# EAGLE design B312B (EAGLE 6.6.0)
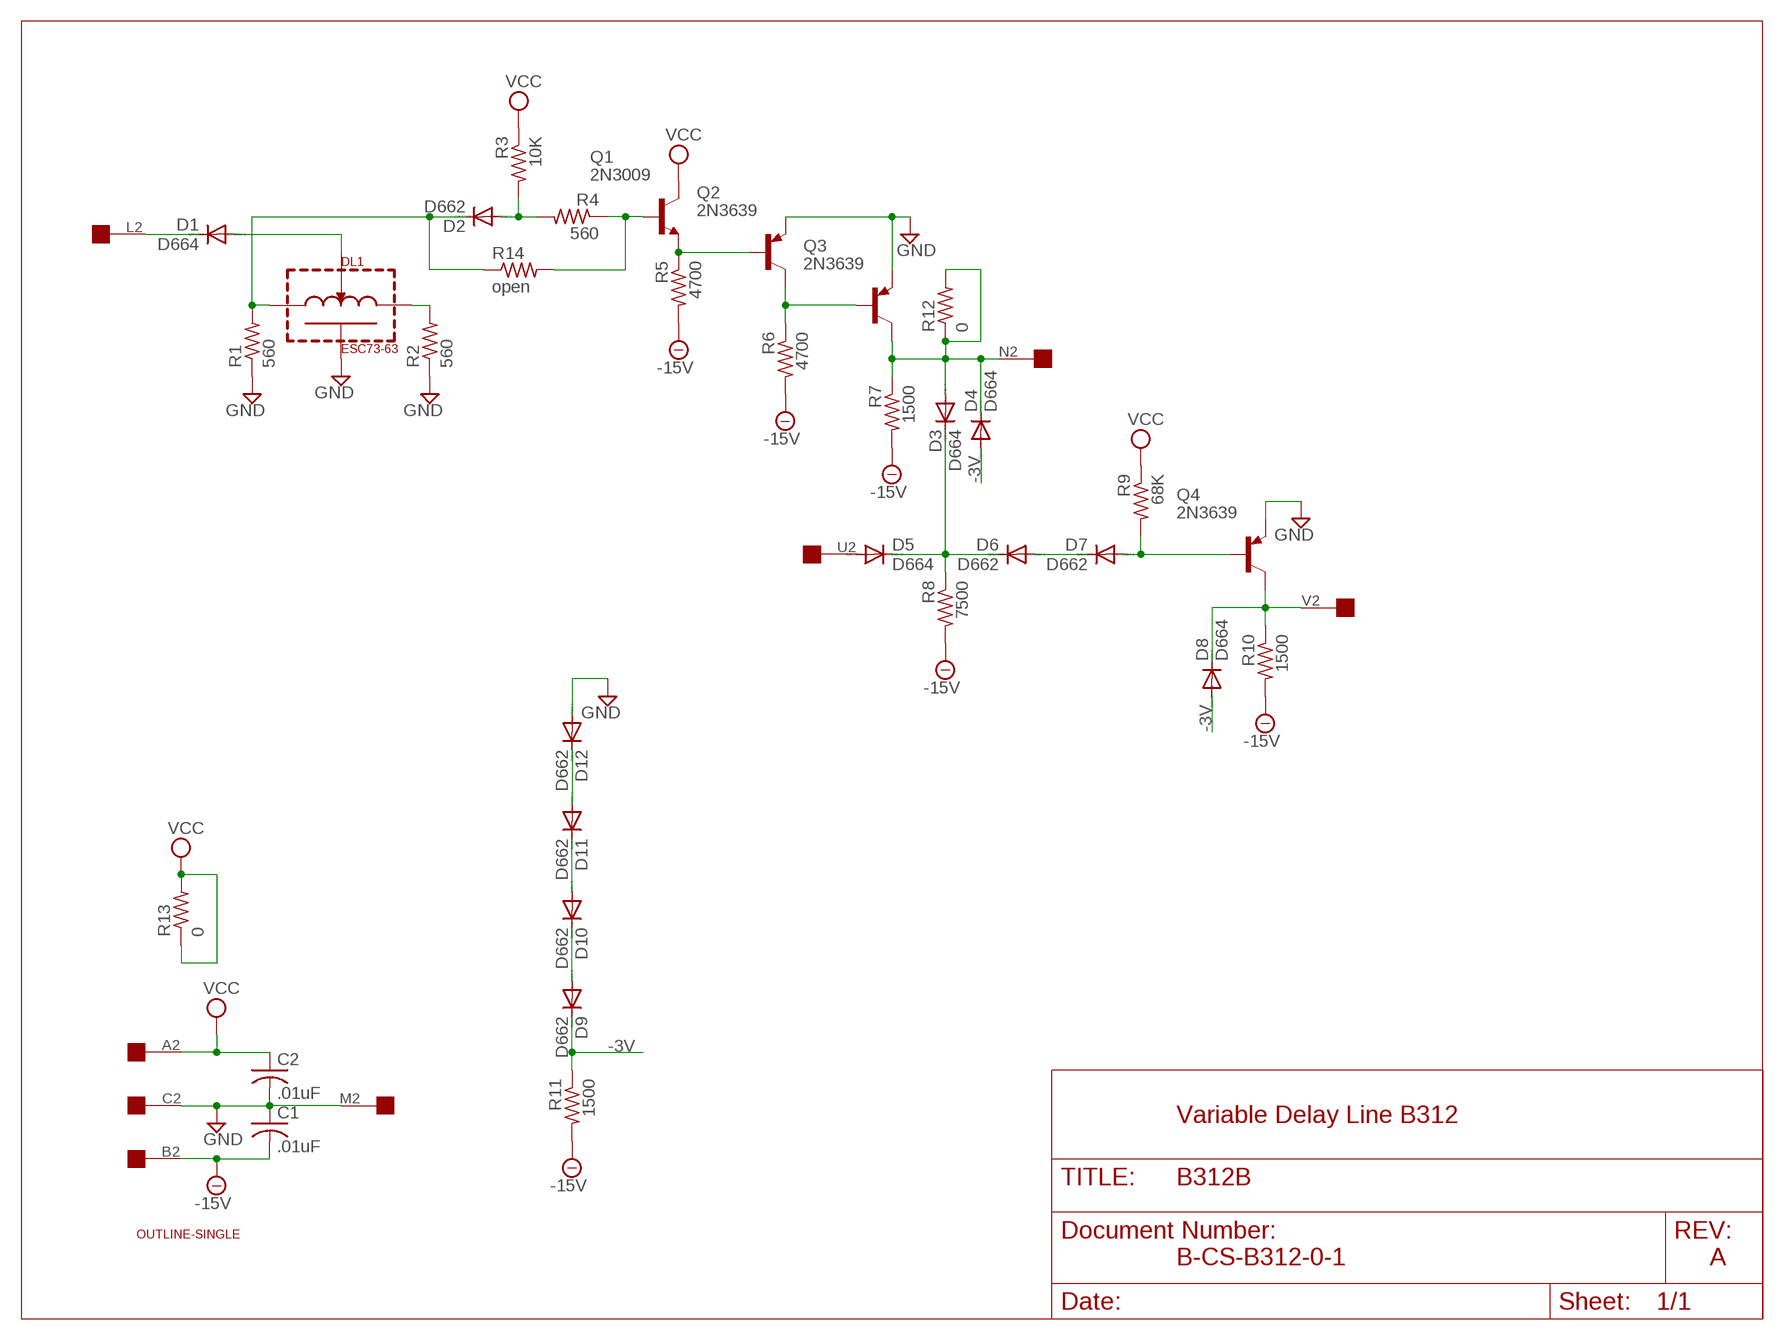
[diagram p0: schematic, sheet 1]

## Parts
C1  .01uF  C-US  [C063-025X075]
C2  .01uF  C-US  [C063-025X075]
D1  D664  DIODE-DO35-10  [DO35-10]
D2  D662  DIODE-DO35-10  [DO35-10]
D3  D664  DIODE-DO35-10  [DO35-10]
D4  D664  DIODE-DO35-10  [DO35-10]
D5  D664  DIODE-DO35-10  [DO35-10]
D6  D662  DIODE-DO35-10  [DO35-10]
D7  D662  DIODE-DO35-10  [DO35-10]
D8  D664  DIODE-DO35-10  [DO35-10]
D9  D662  DIODE-DO35-10  [DO35-10]
D10  D662  DIODE-DO35-10  [DO35-10]
D11  D662  DIODE-DO35-10  [DO35-10]
D12  D662  DIODE-DO35-10  [DO35-10]
DL1  ESC73-63  DELAYLINE  [DELAYLINE]
Q1  2N3009  -NPN-TO5  [TO5]
Q2  2N3639  -PNP-TO5  [TO5]
Q3  2N3639  -PNP-TO5  [TO5]
Q4  2N3639  -PNP-TO5  [TO5]
R1  560  R-US_0207/10  [0207/10]
R2  560  R-US_0207/10  [0207/10]
R3  10K  R-US_0207/10  [0207/10]
R4  560  R-US_0207/10  [0207/10]
R5  4700  R-US_0207/10  [0207/10]
R6  4700  R-US_0207/10  [0207/10]
R7  1500  R-US_0207/10  [0207/10]
R8  7500  R-US_0207/10  [0207/10]
R9  68K  R-US_0207/10  [0207/10]
R10  1500  R-US_0207/10  [0207/10]
R11  1500  R-US_0207/10  [0207/10]
R12  0  R-US_0207/10  [0207/10]
R13  0  R-US_0207/10  [0207/10]
R14  open  R-US_0207/10  [0207/10]
U$1  OUTLINE-SINGLE  [SINGLE]
U$2  EDGE-1  [EDGE-CON1]

## Nets
-3V: D4.A D8.A D9.C R11.1
-15V: C1.2 R5.2 R6.2 R7.2 R8.2 R10.2 R11.2 U$2.B2
GND: C1.1 C2.2 D12.A DL1.G Q2.1(E) Q3.1(E) Q4.1(E) R1.1 R2.1 U$2.C2 U$2.M2
N$1: D2.C DL1.L R1.2 R14.1
N$2: DL1.R R2.2
N$3: D1.A DL1.V
N$17: D1.C U$2.L2
N$18: D2.A R3.2 R4.2
N$19: Q1.2(B) R4.1 R14.2
N$21: Q1.1(E) Q2.2(B) R5.1
N$22: Q2.3(C) Q3.2(B) R6.1
N$23: D3.A D4.C Q3.3(C) R7.1 R12.1 R12.2 U$2.N2
N$24: D11.A D12.C
N$25: D9.A D10.C
N$26: D10.A D11.C
N$27: D5.A U$2.U2
N$28: D3.C D5.C D6.C R8.1
N$29: D6.A D7.C
N$30: D7.A Q4.2(B) R9.2
N$31: D8.C Q4.3(C) R10.1 U$2.V2
VCC: C2.1 Q1.3(C) R3.1 R9.1 R13.1 R13.2 U$2.A2
Unconnected: U$2.D2 U$2.E2 U$2.F2 U$2.H2 U$2.J2 U$2.K2 U$2.P2 U$2.R2 U$2.S2 U$2.T2

## Notes on the sheet
- Variable Delay Line B312
- B-CS-B312-0-1 | A

## Library data of the parts
C1 C2 = dec-con:C-US: Capacitors with funky DEC lead spacing.
D1-D12 = diode:DIODE-: DIODE
DL1 = dec-con:DELAYLINE: Delay Line
Q1 = transistor:*-NPN-: NPN Transistror BF959 corrected 2008.03.06
Q2-Q4 = transistor:*-PNP-: PNP Transistror
R1-R14 = rcl:R-US_: RESISTOR, American symbol
U$1 = dec-con:OUTLINE-*: Board outlines for DEC boards.
U$2 = dec-con:EDGE-1: Single-Sided DEC Edge Connector -- (side 2)

## Net classes
0 default: width 0.813 mm

## Board
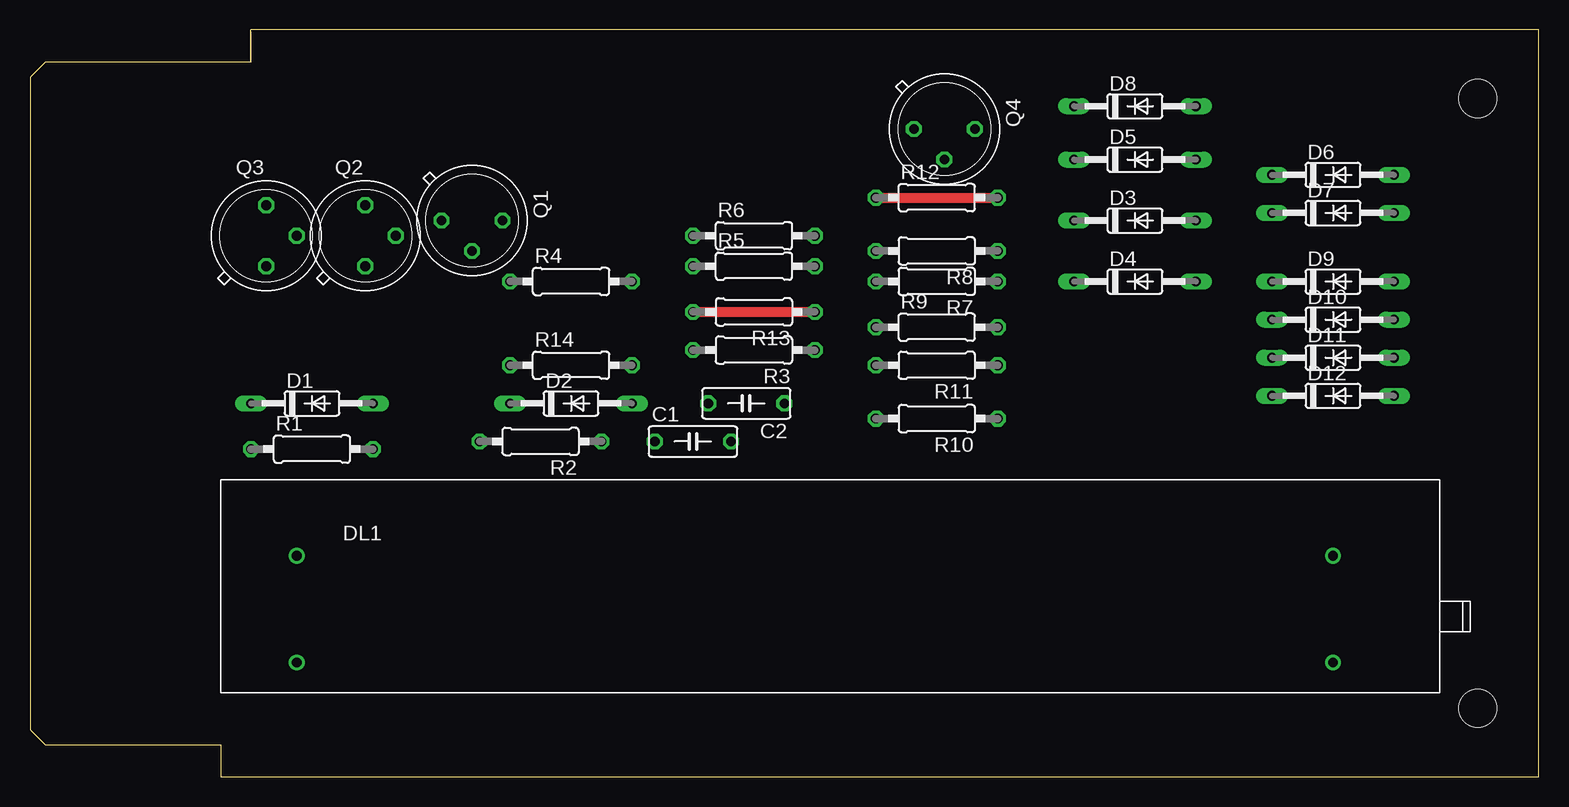
[diagram p1: board, top side]
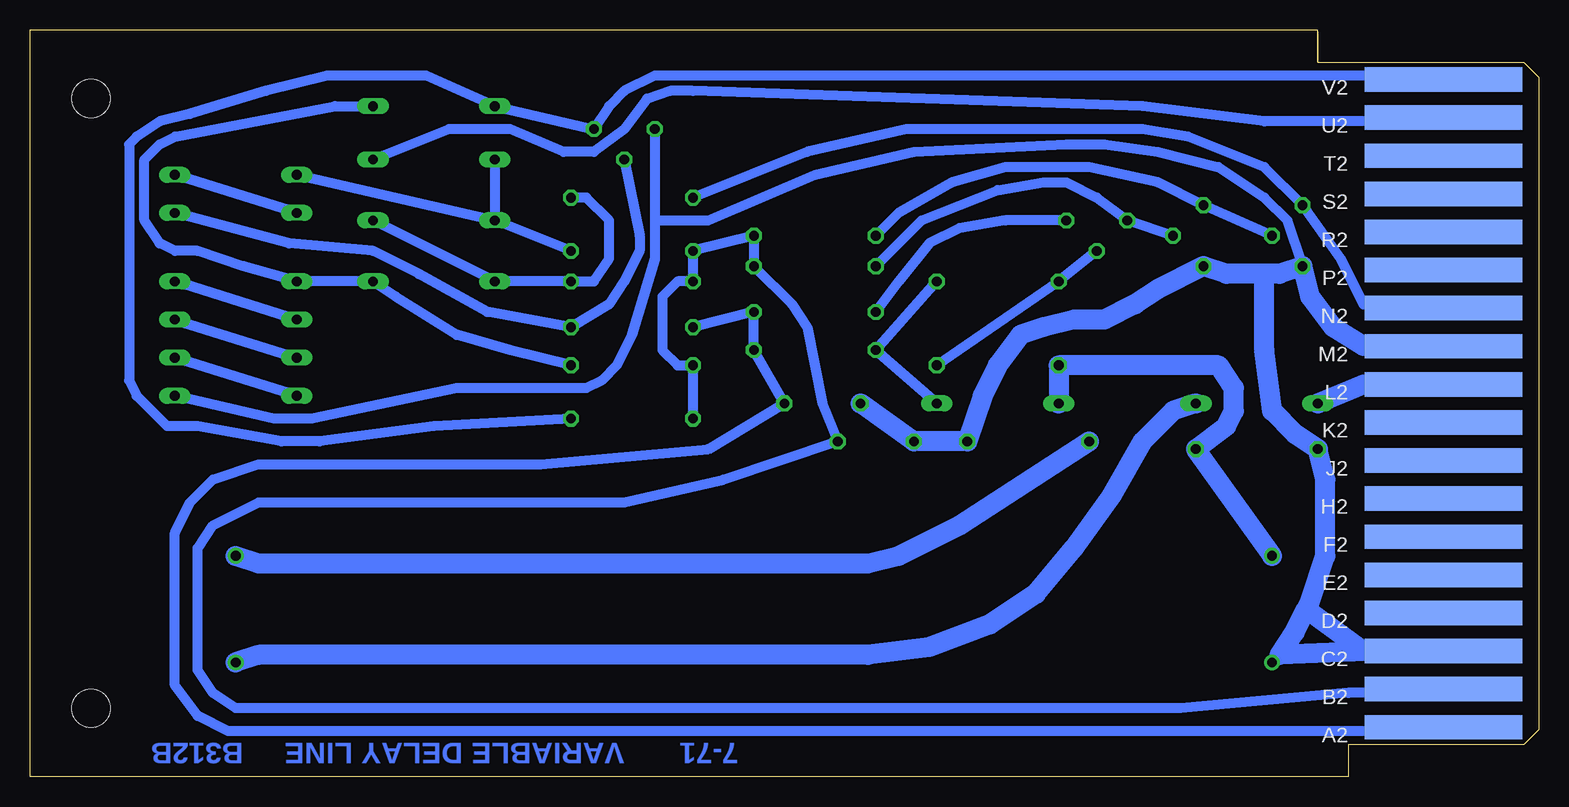
[diagram p2: board, bottom side, seen from below]

Size 125.73 x 62.23 mm. Coordinates in mm from the lower left corner, seen from the top.
Copper layers (1+16): Top 0.035mm / dielectric 1.5mm / Bottom 0.035mm
Design rules "16mils": minimum track width 16mil, minimum drill 32mil, track to track 15mil, track to pad 10mil, pad to pad 10mil, via to via 10mil, smd to smd 10mil, copper to edge 13mil, drill to drill 10mil, minimum pad ring 10mil, minimum via ring 8mil, stop-mask expansion 0mil, vias tented up to drill 0mil, thermal gap 10mil

### Footprints (pad centres in the part's own frame; a part is rotated, then mirrored left to right if it is on the bottom)
C063-025X075 = drill 0.813 octagon: 1 -2.54,0; 2 3.81,0
DO35-10 = drill 0.813 long: A 5.08,0; C -5.08,0
DELAYLINE = drill 0.813: G -44.45,-7.62; L -44.45,1.27; R 41.91,1.27; V 41.91,-7.62
TO5 = drill 0.813 octagon: 1 0,-2.54; 2 2.54,0; 3 0,2.54
0207/10 = drill 0.813 octagon: 1 -5.08,0; 2 5.08,0
SINGLE = hole 3.175: 120.65,56.515; 120.65,5.715
EDGE-CON1 = smd 13.106 x 2.032 bottom: A2 7.938,4.128; B2 7.938,7.303; C2 7.938,10.477; D2 7.938,13.652; E2 7.938,16.828; F2 7.938,20.003; H2 7.938,23.177; J2 7.938,26.352; K2 7.938,29.527; L2 7.938,32.703; M2 7.938,35.877; N2 7.938,39.053; P2 7.938,42.227; R2 7.938,45.403; S2 7.938,48.578; T2 7.938,51.752; U2 7.938,54.928; V2 7.938,58.102

### Placement (x,y rotation side)
C1  54.61,27.94 0 top
C2  60.33,31.11 180 top
D1  23.5,31.11 0 top
D2  45.09,31.11 0 top
D3  92.08,46.35 0 top
D4  92.08,41.27 0 top
D5  92.08,51.44 0 top
D6  108.59,50.16 0 top
D7  108.59,46.99 0 top
D8  92.08,55.88 0 top
D9  108.59,41.27 0 top
D10  108.59,38.1 0 top
D11  108.59,34.92 0 top
D12  108.59,31.75 0 top
DL1  66.68,17.14 0 top
Q1  36.83,46.35 270 top
Q2  27.94,45.09 0 top
Q3  19.69,45.09 0 top
Q4  76.2,53.98 270 top
R1  23.5,27.3 0 top
R2  42.55,27.94 180 top
R3  60.33,35.56 180 top
R4  45.09,41.27 0 top
R5  60.33,42.55 0 top
R6  60.33,45.09 0 top
R7  75.57,41.27 180 top
R8  75.57,43.81 180 top
R9  75.57,37.47 0 top
R10  75.57,29.84 180 top
R11  75.57,34.29 180 top
R12  75.57,48.26 0 top
R13  60.33,38.73 180 top
R14  45.09,34.29 0 top
U$1  0,0 0 top
U$2  0,0 0 top

### Tracks (layer width: path | path; a pad name or v marks a point on that pad's centre or on a via)
-3V
  Bottom 0.813: R11.1 85.73,35.56 90.17,36.83 95.25,40.01 D4.A D9.C 107.95,42.55 111.76,43.81 113.67,43.81 114.94,44.45 116.21,46.35 116.21,51.44 114.94,52.7 113.67,53.34 100.33,55.88 D8.A
-15V
  Bottom 0.813: U$2.B2 10.16,6.99 15.88,6.99 29.85,5.71 108.59,5.71 110.49,6.99 111.76,8.89 111.76,19.05 110.49,20.95 106.68,22.86 76.2,22.86 67.95,24.77 C1.2 59.69,31.11 60.96,37.47 62.23,39.37 R5.2 R6.2 R8.2 R7.2 71.76,41.27 73.03,40.01 73.03,35.56 71.76,34.29 R11.2 R10.2
GND
  Bottom 0.813: U$2.M2 14.61,35.88 | U$2.C2 13.97,10.48 14.29,10.48 | 21.59,10.16 DL1.G | Q4.1 73.66,46.35 | 73.66,46.35 69.22,46.35 60.33,50.16 52.07,52.07 39.37,52.7 36.2,52.7 31.75,52.07 26.67,50.8 22.86,48.26 20.96,46.35 Q3.1 | 73.66,46.35 73.66,43.18 75.57,36.83 76.84,34.29 78.11,33.02 79.38,32.38 90.17,32.38 102.24,29.84 105.41,29.84 D12.A
  Bottom 1.676: C2.2 C1.1 R2.1 46.36,31.75 45.09,34.29 43.18,36.83 41.28,37.47 38.74,38.1 36.2,38.1 33.66,39.37 31.75,40.64 Q2.1 26.04,41.91 22.86,41.91 | 22.86,41.91 21.59,41.91 Q3.1 19.05,40.01 17.15,37.47 14.61,35.88 | 14.29,10.48 21.59,10.16 20.32,12.06 19.37,13.97 | 19.37,13.97 19.05,14.61 17.78,18.41 17.78,24.77 R1.1 20.32,28.57 22.23,30.48 22.86,35.56 22.86,41.91 | 13.97,10.48 14.61,10.48 19.37,13.97
N$1
  Bottom 1.676: D2.C R14.1 26.67,34.29 25.4,32.38 25.4,30.48 26.04,29.21 R1.2 DL1.L
N$2
  Bottom 1.676: DL1.R 106.68,17.78 55.88,17.78 53.34,18.41 48.26,20.95 R2.2
N$3
  Bottom 1.676: D1.A 30.48,30.48 33.02,27.94 35.56,23.5 38.74,19.05 41.91,15.24 45.72,12.7 50.8,10.79 55.88,10.16 106.68,10.16 DL1.V
N$17
  Bottom 0.813: U$2.L2 14.61,32.7
  Bottom 1.676: 14.61,32.7 D1.C
N$18
  Bottom 0.813: R4.2 R3.2 D2.A
N$19
  Bottom 0.813: R14.2 R4.1 Q1.2
N$21
  Bottom 0.813: R5.1 51.44,46.35 45.09,48.9 41.28,49.53 39.37,49.53 36.83,48.26 Q1.1 Q2.2
N$22
  Bottom 0.813: Q3.2 Q2.3 31.75,49.53 37.47,50.8 44.45,50.8 48.9,49.53 53.34,46.99 R6.1
N$23
  Top 0.813: R12.1 R12.2
  Bottom 0.813: U$2.N2 8.89,39.37 14.61,39.37 16.51,43.18 Q3.3 22.86,50.8 29.21,53.34 33.02,53.98 52.71,53.98 60.96,52.07 R12.1 | R12.2 79.38,48.26 77.47,46.35 77.47,43.18 78.74,41.27 R7.1 D4.C D3.A
N$24
  Bottom 0.813: D12.C D11.A
N$25
  Bottom 0.813: D10.C D9.A
N$26
  Bottom 0.813: D10.A D11.C
N$27
  Bottom 0.813: U$2.U2 8.89,54.61 22.86,54.61 33.02,55.88 70.49,57.15 72.39,57.15 74.3,56.52 76.2,53.98 78.74,52.07 81.28,52.07 85.73,53.98 90.81,53.98 D5.A
N$28
  Bottom 0.813: D5.C D3.C | R8.1 D3.C | D6.C D3.C
N$29
  Bottom 0.813: D7.C D6.A
N$30
  Bottom 0.813: D7.A 104.14,44.45 97.16,43.81 93.35,41.91 87.63,38.73 R9.2 77.47,39.37 76.2,41.27 74.93,43.81 74.93,45.09 Q4.2
N$31
  Bottom 0.813: U$2.V2 8.89,58.42 73.66,58.42 76.2,57.15 77.47,55.88 Q4.3 D8.C 92.71,58.42 100.97,58.42 106.05,57.15 112.4,55.24 114.94,54.61 116.84,53.34 117.48,52.7 117.48,33.02 116.84,31.75 114.3,29.21 111.76,29.21 104.78,27.94 101.6,27.94 92.08,29.21 R10.1
VCC
  Top 0.813: R13.2 R13.1
  Bottom 0.813: U$2.A2 8.89,3.81 109.22,3.81 111.76,5.08 113.67,7.62 113.67,20.32 112.4,22.86 110.49,24.77 106.68,26.04 83.19,26.04 69.22,27.3 C2.1 R3.1 R13.1 R9.1 | Q1.3 44.45,46.35 48.26,45.72 50.8,44.45 53.34,41.27 R13.2

### Text on the board
Bottom: 7-71 | VARIABLE DELAY LINE | B312B
200bmp: C:/Users/Vince/Documents/eagle/projects/DEC/Bxxx/B312/B312Bbackfb.bmp